# Altium schematic sheet Sheet1.SchDoc (part 3 of 3)
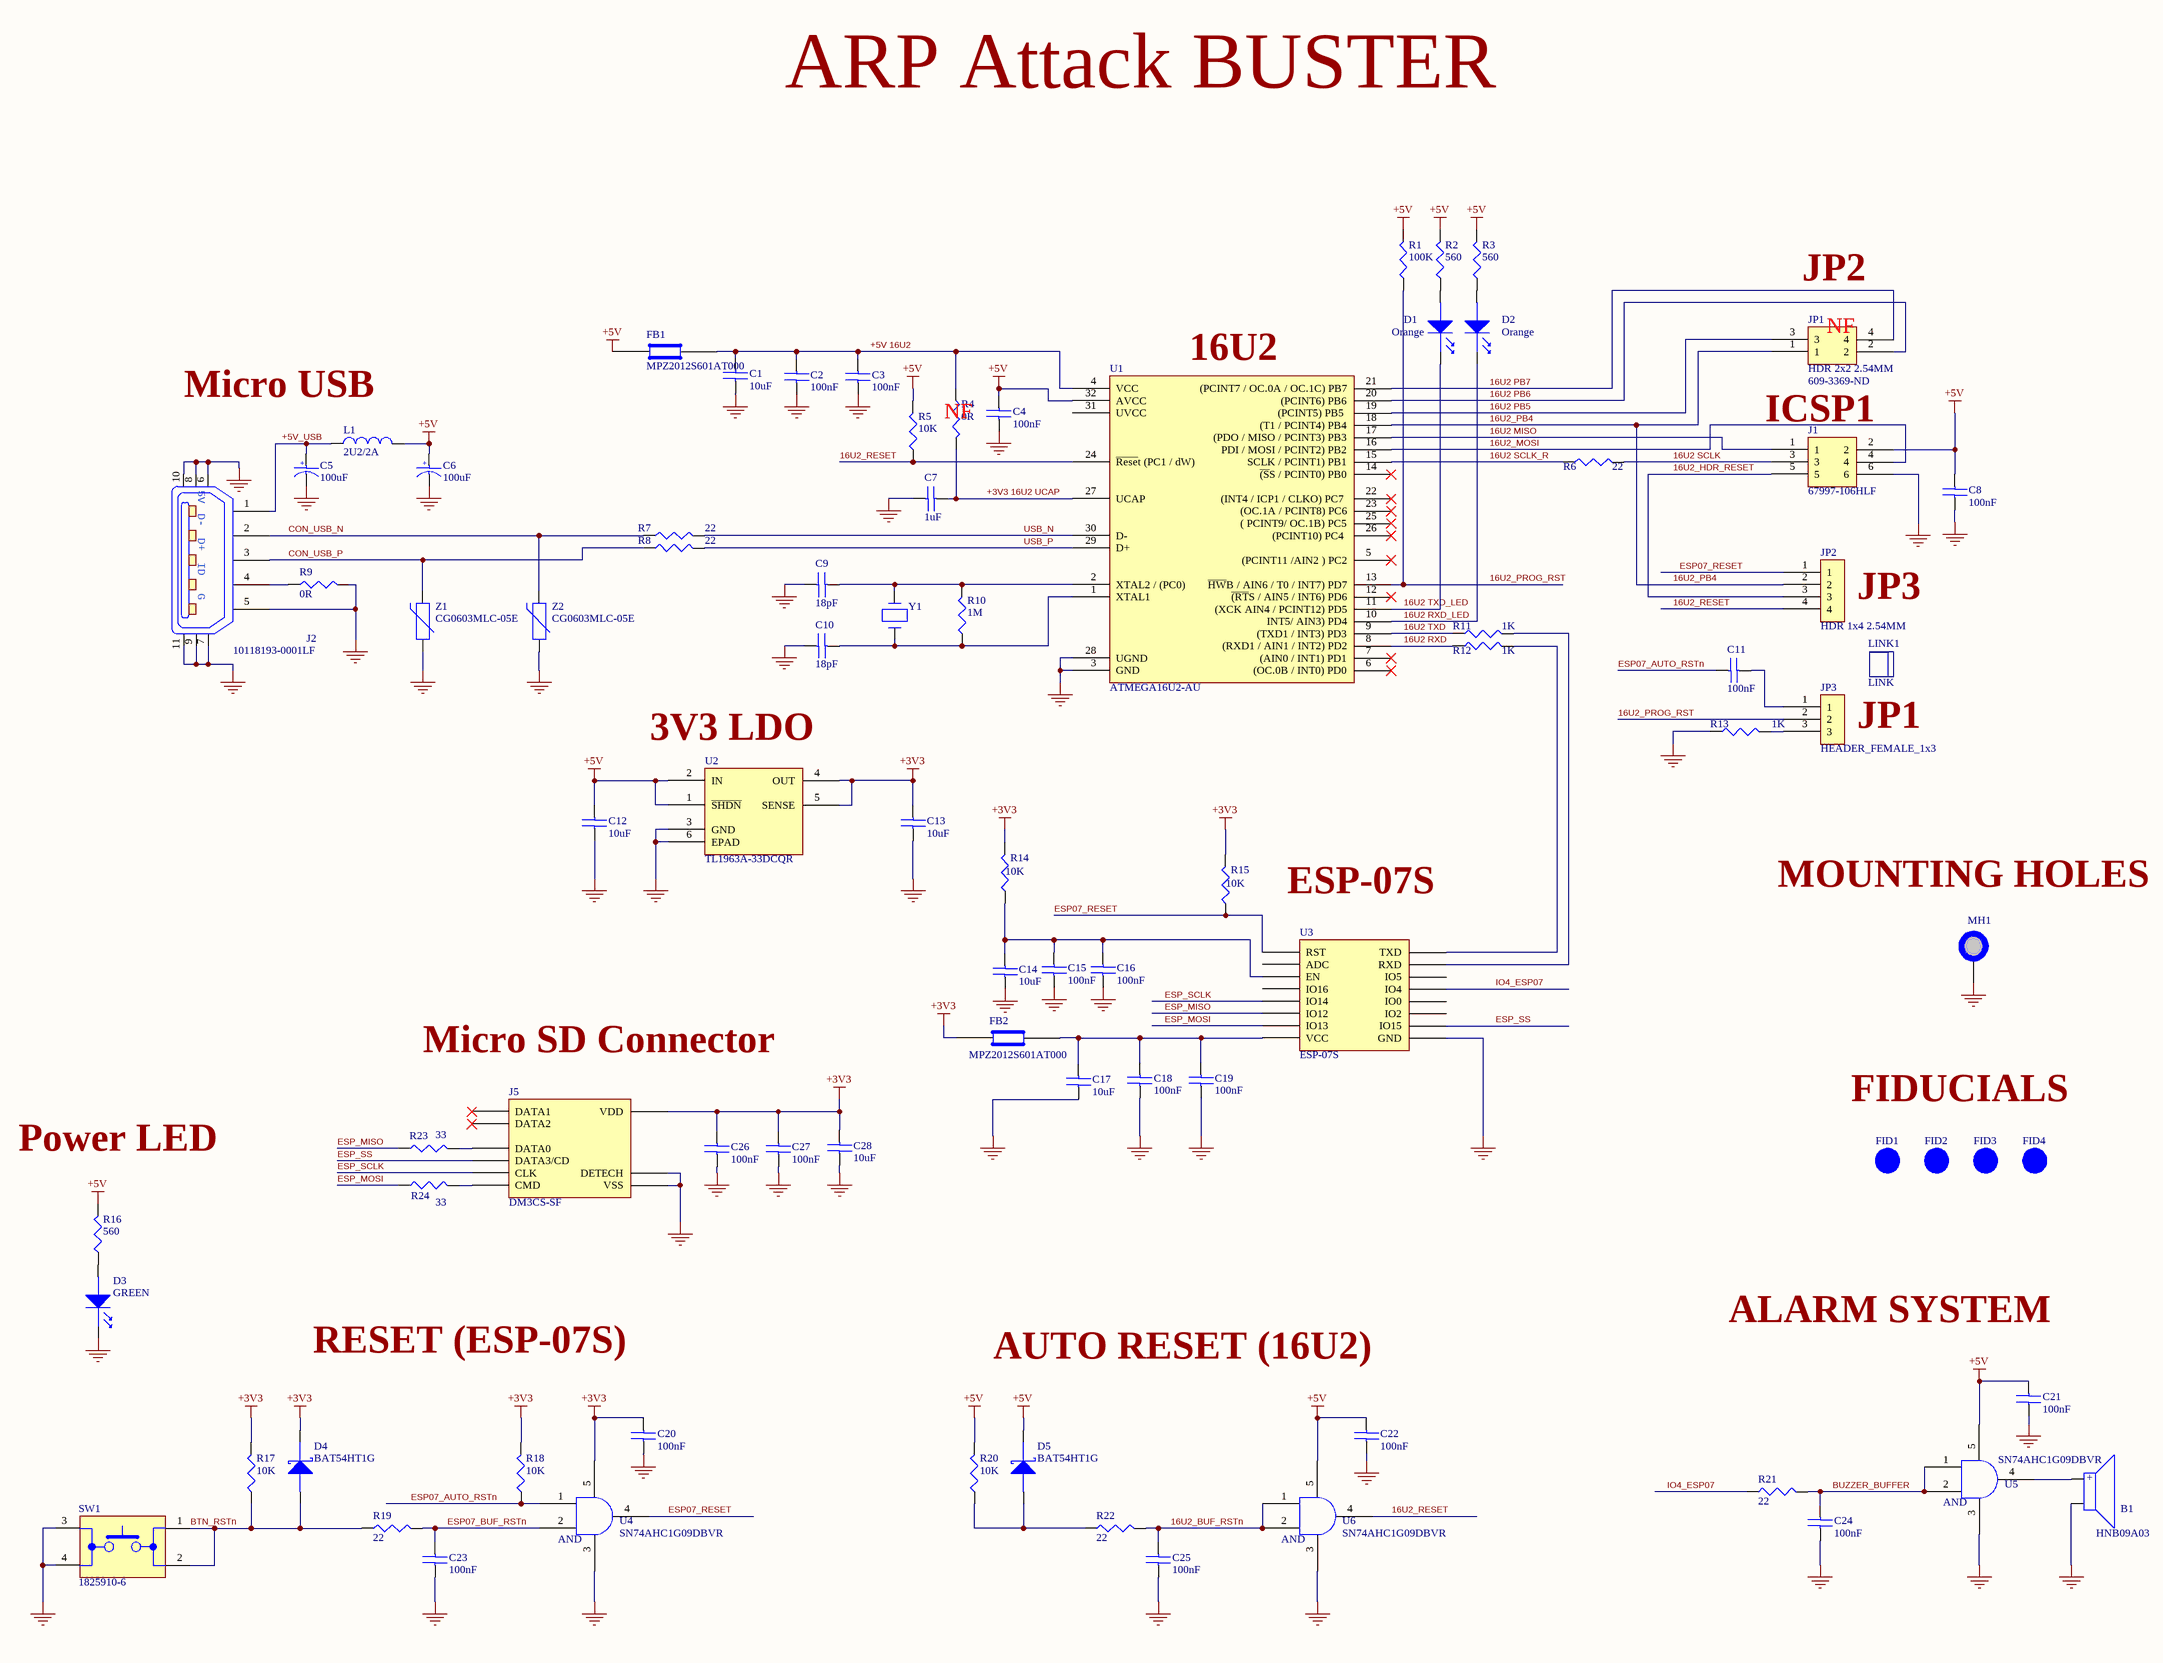
[diagram p2: Sheet1.SchDoc]

## Library data of the parts (continued)
U2 = TL1963A-33DCQR: LDO Regulator Pos 3.3V 1.5A 6-Pin(5+Tab) SOT-223 T/R; Manufacturer: Texas Instruments; Dropout Voltage: 340mV; Number of Outputs: 1; Max Input Voltage: 20V; Min Input Voltage: 2.1V; Min Current Limit: 1.6A; Input Bias Current: 1mA; Polarity: Positive; Accuracy: 3%; Output Type: Fixed; Supplier 1: Digi-Key; Manufacturer Part Number: TL1963A-33DCQR; RoHS: Yes; Category: Voltage Regulators - Linear; Pricing 1: 1=3.62000, 10=3.25200, 25=3.07440, 100=2.66440, 250=2.52772, 500=2.26812, 1000=2.25575 (USD); Case/Package: SOT-223; Number of Pins: 6; Contact Plating: Gold; Min Operating Temperature: -40°C; Max Operating Temperature: 125°C; Package Quantity: 1; Packaging: Tape and Reel; Output Voltage: 3.3V; Output Current: 1.5A; Max Output Current: 1.5A; Number of Regulators: 1; Quiescent Current: 1mA; Max Output Voltage: 3.3V; Min Output Voltage: 3.3V; Series: -; Radiation Hardening: No; Lead Free: Lead Free; RoHS Compliant: Yes; ComponentLink1URL: https://datasheet.ciiva.com/2046/tl1963a-2046161.pdf?src-supplier=Digi-Key; ComponentLink1Description: https://datasheet.ciiva.com/2046/tl1963a-2046161.pdf?src-supplier=Digi-Key; ComponentLink2URL: https://datasheet.ciiva.com/2046/tl1963a-2046162.pdf?src-supplier=Digi-Key; ComponentLink2Description: https://datasheet.ciiva.com/2046/tl1963a-2046162.pdf?src-supplier=Digi-Key; ComponentLink3URL: https://datasheet.ciiva.com/2046/tl1963a-2046163.pdf?src-supplier=Digi-Key; ComponentLink3Description: https://datasheet.ciiva.com/2046/tl1963a-2046163.pdf?src-supplier=Digi-Key; ComponentLink4URL: https://datasheet.ciiva.com/26176/tl1963a-25-26176569.pdf?src-supplier=Avnet+Europe; ComponentLink4Description: https://datasheet.ciiva.com/26176/tl1963a-25-26176569.pdf?src-supplier=Avnet+Europe; Supplier Part Number 1: 296-24534-6-ND
U3 = ESP-07S: Wifi Module, 2.484Ghz, 9 I/o Port Rohs Compliant: Yes; Manufacturer: RF Solutions; Manufacturer Part Number: ESP-12S; Interface: I2C,SPI,UART; Sensitivity: -90dBm; Data Rate: 54Mbps; RoHS: No; Category: RF Receivers, Transceivers; Frequency: 2.484GHz; ComponentLink1URL: http://www.farnell.com/datasheets/2575856.pdf?src-supplier=Farnell; ComponentLink1Description: http://www.farnell.com/datasheets/2575856.pdf?src-supplier=Farnell; ComponentLink2URL: https://www.rfsolutions.co.uk/downloads/1513856197DS-ESP-12S.pdf?src-supplier=Digi-Key; ComponentLink2Description: https://www.rfsolutions.co.uk/downloads/1513856197DS-ESP-12S.pdf?src-supplier=Digi-Key; Supplier 1: Digi-Key; Supplier Part Number 1: ESP-12SRF-ND
U4-U6 = SN74AHC1G09DBVR: Single 2-input, 2-V to 5.5-V AND gate with open-drain outputs 5-SOT-23 -55 to 125; Manufacturer: Texas Instruments; Min Supply Voltage: 2V; Max Supply Voltage: 5.5V; Quiescent Current: 1uA; Number of Inputs: 2; Propagation Delay: 7.5ns; Output Current: 25mA; Number of Circuits: 1; Low Level Output Current: 8mA; Supplier 1: Digi-Key; Manufacturer Part Number: SN74AHC1G09DBVR; RoHS: Yes; Category: Logic Gates; Pricing 1: 1=0.48000, 10=0.35600, 25=0.31160, 100=0.20170, 250=0.16696, 500=0.13356, 1000=0.10240 (USD); Mount: Surface Mount; Case/Package: SOT-23; Number of Pins: 5; Contact Plating: Tin,Matte; Min Operating Temperature: -55°C; Max Operating Temperature: 125°C; Logic Function: AND GATE; Package Quantity: 3000; Packaging: Tape and Reel; Number of Gates: 1; Number of Elements: 1; Number of Bits: 1; Series: 74AHC; Technology: CMOS; Output Voltage: 5.5V; Number of Outputs: 1; Radiation Hardening: No; REACH SVHC: No SVHC; Lead Free: Lead Free; RoHS Compliant: Yes; ComponentLink1URL: https://datasheet.ciiva.com/1864/sn74ahc1g09-1864410.pdf?src-supplier=Digi-Key; ComponentLink1Description: https://datasheet.ciiva.com/1864/sn74ahc1g09-1864410.pdf?src-supplier=Digi-Key; ComponentLink2URL: https://datasheet.ciiva.com/1864/sn74ahc1g09-1864411.pdf?src-supplier=Digi-Key; ComponentLink2Description: https://datasheet.ciiva.com/1864/sn74ahc1g09-1864411.pdf?src-supplier=Digi-Key; ComponentLink3URL: https://datasheet.ciiva.com/1864/sn74ahc1g09-1864412.pdf?src-supplier=Digi-Key; ComponentLink3Description: https://datasheet.ciiva.com/1864/sn74ahc1g09-1864412.pdf?src-supplier=Digi-Key; Supplier Part Number 1: 296-29202-1-ND
Y1 = ABM7-16.000MHZ-D2Y-T: Crystal 16MHz ±20ppm (Tol) ±30ppm (Stability) 18pF FUND 50Ohm 2-Pin Mini-CSMD T/R; Manufacturer: Abracon; ESR (Equivalent Series Resistance): 50R; Supplier 1: RSComponents; Manufacturer Part Number: ABM7-16.000MHZ-D2Y-T; RoHS: Yes; Category: Crystals; Stock 1: 710; Pricing 1: 1000=0.52200, 3000=0.50800 (USD); Mount: Surface Mount; Case/Package: CSMD; Number of Pins: 2; Min Operating Temperature: -40°C; Max Operating Temperature: 85°C; Frequency Tolerance: 20ppm; Load Capacitance: 18pF; Frequency: 16MHz; Package Quantity: 1000; Tolerance: 20ppm; Packaging: Tape and Reel; Frequency Stability: 30ppm; Termination: SMD/SMT; Resistor Type: Ceramic; Length: 6mm; Width: 3.3mm; Height: 0.055inch; Depth: 3.5mm; Radiation Hardening: No; REACH SVHC: Unknown; Lead Free: Lead Free; ComponentLink1URL: https://datasheet.ciiva.com/15116/getdatasheetpartid-721624-15116835.pdf?src-supplier=Verical; ComponentLink1Description: https://datasheet.ciiva.com/15116/getdatasheetpartid-721624-15116835.pdf?src-supplier=Verical; ComponentLink2URL: https://datasheet.ciiva.com/22658/947971-22658293.pdf?src-supplier=Element14; ComponentLink2Description: https://datasheet.ciiva.com/22658/947971-22658293.pdf?src-supplier=Element14; ComponentLink3URL: https://datasheet.ciiva.com/5788/abm7-5788054.pdf?src-supplier=Farnell; ComponentLink3Description: https://datasheet.ciiva.com/5788/abm7-5788054.pdf?src-supplier=Farnell; ComponentLink4URL: https://datasheet.ciiva.com/7998/947971-7998600.pdf?src-supplier=Element14; ComponentLink4Description: https://datasheet.ciiva.com/7998/947971-7998600.pdf?src-supplier=Element14; ComponentLink5URL: https://datasheet.ciiva.com/46385/947971-46385243.pdf?src-supplier=Element14; ComponentLink5Description: https://datasheet.ciiva.com/46385/947971-46385243.pdf?src-supplier=Element14; ComponentLink6URL: https://datasheet.ciiva.com/16383/abm7-16383174.pdf?src-supplier=Future+Electronics; ComponentLink6Description: https://datasheet.ciiva.com/16383/abm7-16383174.pdf?src-supplier=Future+Electronics; ComponentLink7URL: https://datasheet.ciiva.com/18649/abm7-18649865.pdf?src-supplier=Digi-Key; ComponentLink7Description: https://datasheet.ciiva.com/18649/abm7-18649865.pdf?src-supplier=Digi-Key; ComponentLink8URL: https://datasheet.ciiva.com/18649/abm7-18649866.pdf?src-supplier=Digi-Key; ComponentLink8Description: https://datasheet.ciiva.com/18649/abm7-18649866.pdf?src-supplier=Digi-Key; ComponentLink9URL: https://datasheet.ciiva.com/18649/abm7-18649867.pdf?src-supplier=Digi-Key; ComponentLink9Description: https://datasheet.ciiva.com/18649/abm7-18649867.pdf?src-supplier=Digi-Key; ComponentLink10URL: https://datasheet.ciiva.com/26941/getdatasheetpartid-719818-26941724.pdf?src-supplier=Verical; ComponentLink10Description: https://datasheet.ciiva.com/26941/getdatasheetpartid-719818-26941724.pdf?src-supplier=Verical; Supplier Part Number 1: 1710290
Z1 Z2 = CG0603MLC-05E: ESD Suppressor Multilayer Varistor 5V Automotive 2-Pin Case 0603(1608Metric) T/R; Manufacturer: Bourns; Capacitance: 0.5pF; Voltage Rating (AC): 8V; Number of Channels: 1; Clamping Voltage: 20V; Current Rating: 50nA; Turn-On Delay Time: 1ns; Element Configuration: Single; Supplier 1: Digi-Key; Manufacturer Part Number: CG0603MLC-05E; RoHS: Yes; Category: Varistors; Stock 1: 69840; Pricing 1: 5000=0.08840, 10000=0.08060, 25000=0.07540, 50000=0.06916 (USD); Case/Package: 0603; Number of Pins: 2; Case Code (Imperial): 0603; Case Code (Metric): 1608; Contact Plating: Tin; Min Operating Temperature: -40°C; Max Operating Temperature: 85°C; Voltage Rating (DC): 5V; Operating Supply Voltage: 5V; Package Quantity: 1; Packaging: Tape and Reel; Termination: SMD/SMT; Voltage: 5V; Number of Circuits: 1; Max Voltage Rating (DC): 5V; Working Voltage: 5V; Leakage Current: 50nA; Series: MLC; Length: 1.6mm; Width: 0.8mm; Depth: 0.8mm; Thickness: 0.8mm; Radiation Hardening: No; REACH SVHC: No SVHC; RoHS Compliant: Yes; ComponentLink1URL: https://datasheet.ciiva.com/27747/1163231-27747629.pdf?src-supplier=Jameco; ComponentLink1Description: https://datasheet.ciiva.com/27747/1163231-27747629.pdf?src-supplier=Jameco; ComponentLink2URL: https://datasheet.ciiva.com/30070/mlc-30070503.pdf?src-supplier=Onlinecomponents.com; ComponentLink2Description: https://datasheet.ciiva.com/30070/mlc-30070503.pdf?src-supplier=Onlinecomponents.com; ComponentLink3URL: https://datasheet.ciiva.com/6991/mlc-6991832.pdf?src-supplier=Digi-Key; ComponentLink3Description: https://datasheet.ciiva.com/6991/mlc-6991832.pdf?src-supplier=Digi-Key; ComponentLink4URL: https://datasheet.ciiva.com/6991/mlc-6991834.pdf?src-supplier=Digi-Key; ComponentLink4Description: https://datasheet.ciiva.com/6991/mlc-6991834.pdf?src-supplier=Digi-Key; ComponentLink5URL: https://datasheet.ciiva.com/6991/mlc-6991836.pdf?src-supplier=Digi-Key; ComponentLink5Description: https://datasheet.ciiva.com/6991/mlc-6991836.pdf?src-supplier=Digi-Key; ComponentLink6URL: https://datasheet.ciiva.com/1278/1785244-1278701.pdf?src-supplier=Element14; ComponentLink6Description: https://datasheet.ciiva.com/1278/1785244-1278701.pdf?src-supplier=Element14; ComponentLink7URL: https://datasheet.ciiva.com/22696/1785244-22696318.pdf?src-supplier=Element14; ComponentLink7Description: https://datasheet.ciiva.com/22696/1785244-22696318.pdf?src-supplier=Element14; ComponentLink8URL: https://datasheet.ciiva.com/25958/mlc-25958222.pdf?src-supplier=Avnet+Europe; ComponentLink8Description: https://datasheet.ciiva.com/25958/mlc-25958222.pdf?src-supplier=Avnet+Europe; ComponentLink9URL: https://datasheet.ciiva.com/8084/mlc-8084047.pdf?src-supplier=Avnet; ComponentLink9Description: https://datasheet.ciiva.com/8084/mlc-8084047.pdf?src-supplier=Avnet; Supplier Part Number 1: CG0603MLC-05ETR-ND